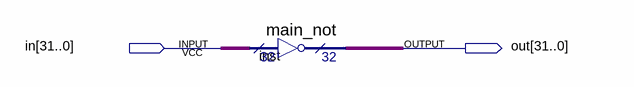
[diagram p0: schematic sheet]
// Quartus schematic not.bdf as structural Verilog: 1 symbols, 2 pins
module \not  (
  input  [31:0] in,
  output [31:0] out
);

  main_not inst (.data(in), .result(out));
endmodule
